# Altium schematic sheet SheetMain.SchDoc
size A
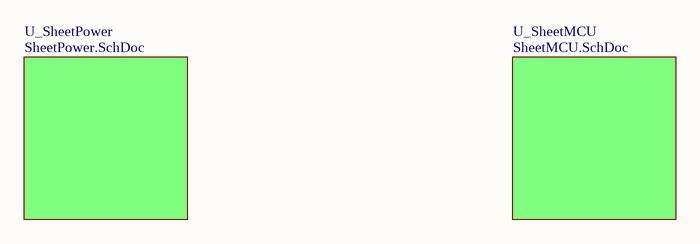
[diagram p0: SheetMain.SchDoc]

## Sub-sheets
U_SheetMCU = SheetMCU.SchDoc: no entries
U_SheetPower = SheetPower.SchDoc: no entries